# EAGLE schematic untitled (EAGLE 9.3.0)
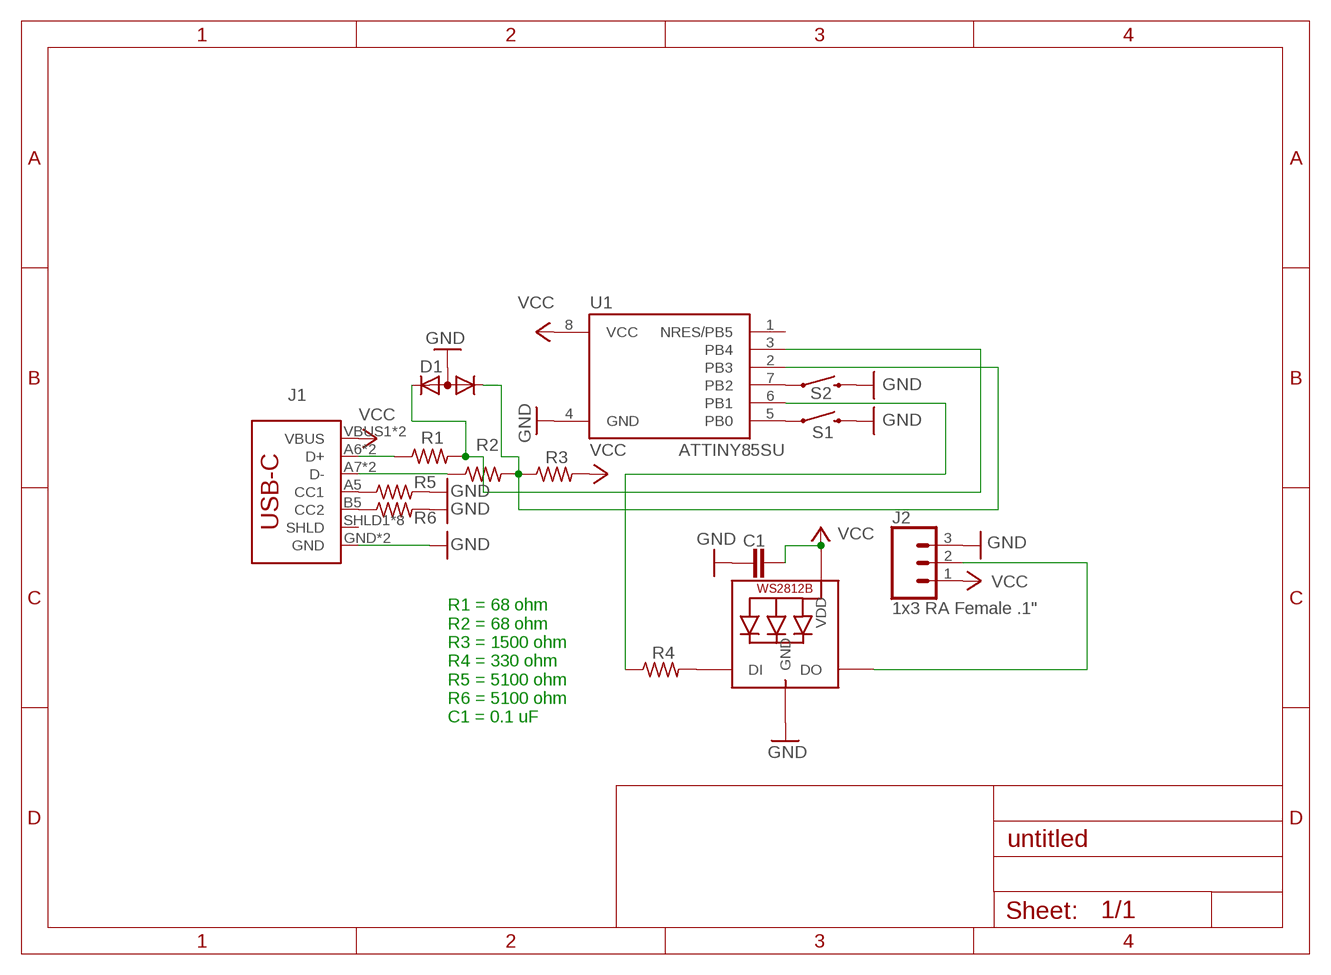
[diagram p0: schematic, sheet 1]

## Parts
C1  CC1206  [C1206]
D1  DIODE_CA-AC__  [SOT23C]
J1  USB_C16PIN  [USB-C-16P]
J2  1x3 RA Female .1"  CONN_03SMD_RA_FEMALE  [1X03_SMD_RA_FEMALE]
LED1  WS2812B5050  [WS2812B]
R1  R-US_R3216  [R3216]
R2  R-US_R3216  [R3216]
R3  R-US_R3216  [R3216]
R4  R-US_R3216  [R3216]
R5  R-US_R3216  [R3216]
R6  R-US_R3216  [R3216]
S1  MOMENTARY-SWITCH-SPST-SMD-6.0X3.5MM  [TACTILE_SWITCH_SMD_6.0X3.5MM]
S2  MOMENTARY-SWITCH-SPST-SMD-6.0X3.5MM  [TACTILE_SWITCH_SMD_6.0X3.5MM]
U1  ATTINY85SU  [ATTINY85]

## Nets
GND: C1.1 D1.3(A) J1.GND J1.GND2(GND) J2.3 LED1.3-GND(GND) R5.2 R6.2 S1.2 S2.2 U1.4(GND)
N$1: J2.2 LED1.2-DOUT(DO)
N$2: R4.1 U1.6(PB1)
N$3: LED1.4-DIN(DI) R4.2
N$4: J1.A5(CC1) R5.1
N$5: J1.B5(CC2) R6.1
N$6: S1.1 U1.5(PB0)
N$7: J1.A6(D+) J1.B6(D+) R1.1
N$8: J1.A7(D-) J1.B7(D-) R2.1
N$9: D1.2(K2) R1.2 U1.3(PB4)
N$10: D1.1(K1) R2.2 R3.1 U1.2(PB3)
N$11: S2.1 U1.7(PB2)
VCC: C1.2 J1.VBUS1(VBUS) J1.VBUS2(VBUS) J2.1 LED1.1-VDD(VDD) R3.2 U1.8(VCC)
Unconnected: J1.SHLD1(SHLD) J1.SHLD2(SHLD) J1.SHLD3(SHLD) J1.SHLD4(SHLD) J1.SHLD5(SHLD) J1.SHLD6(SHLD) J1.SHLD7(SHLD) J1.SHLD8(SHLD) U1.1(NRES/PB5)

## Notes on the sheet
- R1 = 68 ohm
  R2 = 68 ohm
  R3 = 1500 ohm
  R4 = 330 ohm
  R5 = 5100 ohm
  R6 = 5100 ohm
  C1 = 0.1 uF

## Library data of the parts
C1 = eagle-ltspice:C: CAPACITOR, European symbol; SPICEMODEL: NONE; SPICEPREFIX: C
D1 = semicon-smd-ipc:DIODE_CA-AC_: DUAL DIODE
J1 = SparkFun-Connectors:USB_C: USB Type C 16Pin Connector Super Speed pins not available on the 16-pin purely SMD connector so this part is best for USB 2.0 implementations. D1 and D2 are tied together enabling D+/- no matter which way the cable is plugged into the connector. The two channel configuration pins (CC1/2) are exposed. These are normally connected to ground via 5.1k resistors but can be reconfigured for high current/high power applications.; PROD_ID: CONN-14122
J2 = SparkFun-Connectors:CONN_03: Multi connection point. Often used as Generic Header-pin footprint for 0.1 inch spaced/style header connections On any of the 0.1 inch spaced packages, you can populate with these: Break Away Headers - Straight <https://www.sparkfun.com/products/116> (PRT-00116) Break Away Male Headers - Right Angle <https://www.sparkfun.com/products/553> (PRT-00553) Female Headers <https://www.sparkfun.com/products/115> (PRT-00115) Break Away Headers - Machine Pin <https://www.sparkfun.com/products/117> (PRT-00117) Break Away Female Headers - Swiss Machine Pin <https://www.sparkfun.com/products/743> (PRT-00743) Stackable Header - 3 Pin (Female, 0.1") <https://www.sparkfun.com/products/13875> (PRT-13875) For SCREWTERMINALS and SPRING TERMINALS visit here: Screw Terimnals on SparkFun.com <https://www.sparkfun.com/search/results?term=Screw+Terminals> (5mm/3.5mm/2.54mm spacing) This device is also useful as a general connection point to wire up your design to another part of your project. Our various solder wires solder well into these plated through hole pads. Hook-Up Wire - Assortment (Stranded, 22 AWG) <https://www.sparkfun.com/products/11375> (PRT-11375) Hook-Up Wire - Assortment (Solid Core, 22 AWG) <https://www.sparkfun.com/products/11367> (PRT-11367) View the entire wire category on our website here <https://www.sparkfun.com/categories/141> Special notes: Molex polarized connector foot print use with SKU : PRT-08232 with associated crimp pins and housings.; PROD_ID: CONN-10926
LED1 = adafruit:WS2812B
R1-R6 = adafruit:R-US_: RESISTOR, American symbol
S1 S2 = SparkFun-Switches:MOMENTARY-SWITCH-SPST: Momentary Switch (Pushbutton) - SPST Normally-open (NO) SPST momentary switches (buttons, pushbuttons). Variants PTH-12MM - 12mm square, through-hole Momentary Pushbutton Switch - 12mm Square <https://www.sparkfun.com/products/9190> (COM-09190) PTH-6.0MM, PTH-6.0MM-KIT - 6.0mm square, through-hole Mini Pushbutton Switch <https://www.sparkfun.com/products/97> (COM-00097) KIT package intended for soldering kit's - only one side of pads' copper is exposed. PTH-RIGHT-ANGLE-KIT - Right-angle, through-hole Right Angle Tactile Button <https://www.sparkfun.com/products/10791> - Used on SparkFun BigTime Watch Kit <https://www.sparkfun.com/products/11734> SMD-12MM - 12mm square, surface-mount Tactile Button - SMD (12mm) <https://www.sparkfun.com/products/12993> (COM-12993) Used on SparkFun PicoBoard <https://www.sparkfun.com/products/11888> SMD-4.5MM - 4.5mm Square Trackball Switch Used on SparkFun Blackberry Trackballer Breakout <https://www.sparkfun.com/products/13169> SMD-4.6MMX2.8MM - 4.60mm x 2.80mm, surface mount Used on SparkFun SAMD21 Mini Breakout <https://www.sparkfun.com/products/13664> SMD-5.2MM, SMD-5.2-REDUNDANT - 5.2mm square, surface-mount Mini Pushbutton Switch - SMD <https://www.sparkfun.com/products/8720> (COM-08720) Used on Arduino Pro Mini <https://www.sparkfun.com/products/11114> REDUNDANT package connects both switch circuits together SMD-6.0X3.5MM - 6.0 x 3.5mm, surface mount Momentary Reset Switch SMD <https://www.sparkfun.com/products/8229> (COM-08229) SMD-6.2MM-TALL - 6.2mm square, surface mount Tactile Button - SMD (6mm) <https://www.sparkfun.com/products/12992> Used on SparkFun Digital Sandbox <https://www.sparkfun.com/products/12651> SMD-RIGHT-ANGLE - Right-angle, surface mount Used on SparkFun Block for Intel® Edison - Arduino <https://www.sparkfun.com/products/13036>; PROD_ID: SWCH-00815; SF_SKU: COM-08229
U1 = attiny85:ATTINY85: ATMEL ATtiny 85